# Altium schematic sheet Schematic.SchDoc
size A; SheetNumber: 1; SheetTotal: 1
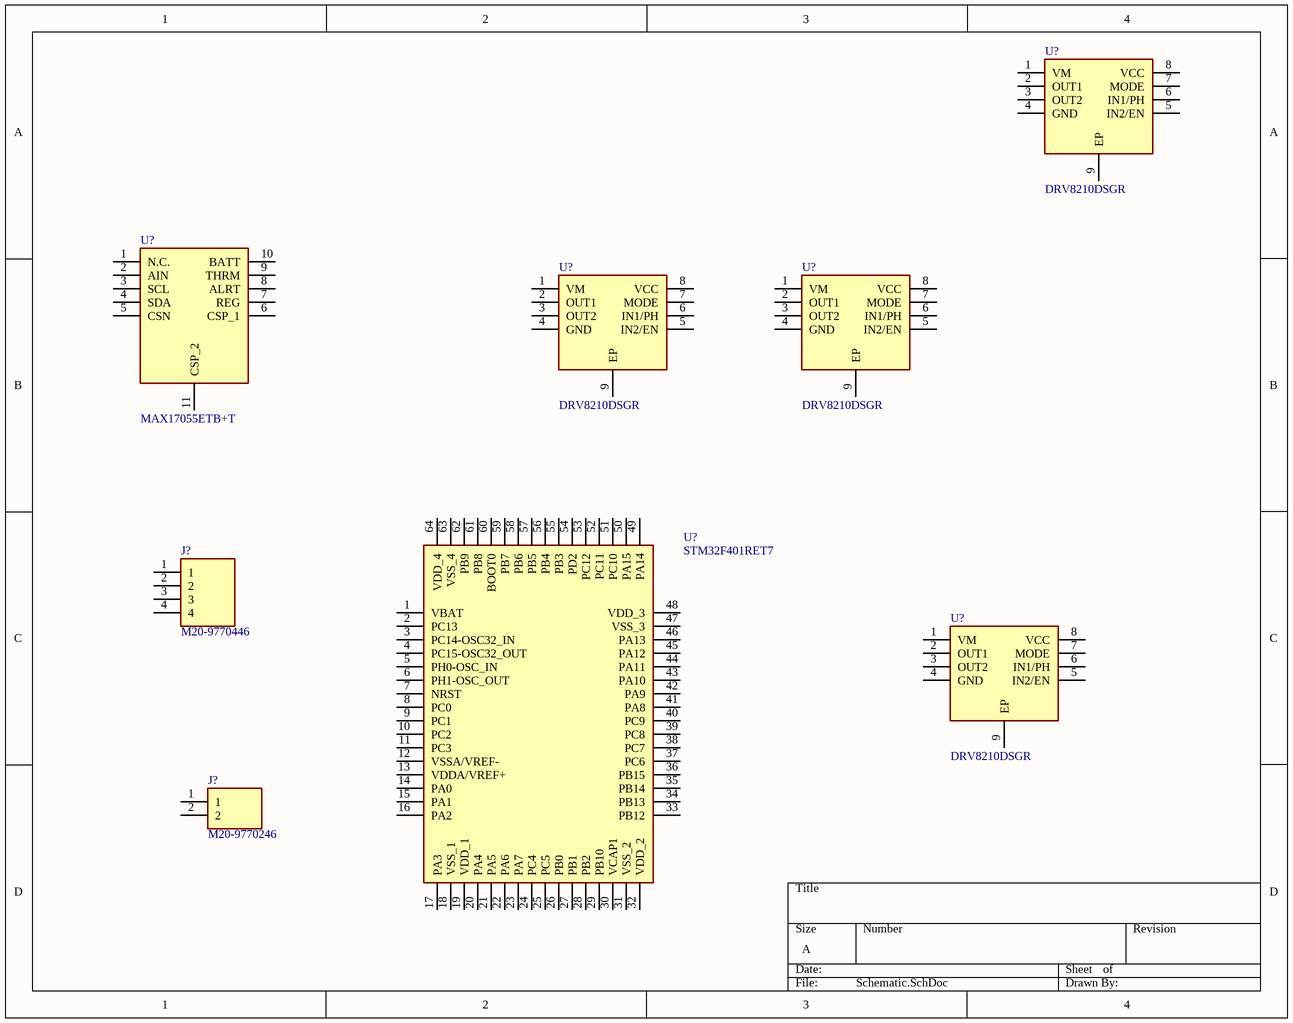
[diagram p0: Schematic.SchDoc]

## Parts
(Parts that share a designator on the sheet are numbered #1, #2 ... from top to bottom, then left to right.)
J?#1  M20-9770446  [HDRV4W64P0X254_1X4_1016X254X834P]
J?#2  M20-9770246  [HDRV2W66P0X254_1X2_508X254X762P]
U?#1  DRV8210DSGR  [SON50P200X200X80-9N]
U?#2  MAX17055ETB+T  [SON40P250X200X80-11N]
U?#3  DRV8210DSGR  [SON50P200X200X80-9N]
U?#4  DRV8210DSGR  [SON50P200X200X80-9N]
U?#5  STM32F401RET7  [QFP50P1200X1200X160-64N]
U?#6  DRV8210DSGR  [SON50P200X200X80-9N]

## Nets

Not connected (* = marked no-connect by the designer): J?#1 1 2 3 4; J?#2 1 2; U?#1 1(VM) 2(OUT1) 3(OUT2) 4(GND) 5(IN2/EN) 6(IN1/PH) 7(MODE) 8(VCC) 9(EP); U?#2 1(N.C.) 2(AIN) 3(SCL) 4(SDA) 5(CSN) 6(CSP_1) 7(REG) 8(ALRT) 9(THRM) 10(BATT) 11(CSP_2); U?#3 1(VM) 2(OUT1) 3(OUT2) 4(GND) 5(IN2/EN) 6(IN1/PH) 7(MODE) 8(VCC) 9(EP); U?#4 1(VM) 2(OUT1) 3(OUT2) 4(GND) 5(IN2/EN) 6(IN1/PH) 7(MODE) 8(VCC) 9(EP); U?#5 1(VBAT) 2(PC13) 3(PC14-OSC32_IN) 4(PC15-OSC32_OUT) 5(PH0-OSC_IN) 6(PH1-OSC_OUT) 7(NRST) 8(PC0) 9(PC1) 10(PC2) 11(PC3) 12(VSSA/VREF-) 13(VDDA/VREF+) 14(PA0) 15(PA1) 16(PA2) 17(PA3) 18(VSS_1) 19(VDD_1) 20(PA4) 21(PA5) 22(PA6) 23(PA7) 24(PC4) 25(PC5) 26(PB0) 27(PB1) 28(PB2) 29(PB10) 30(VCAP1) 31(VSS_2) 32(VDD_2) 33(PB12) 34(PB13) 35(PB14) 36(PB15) 37(PC6) 38(PC7) 39(PC8) 40(PC9) 41(PA8) 42(PA9) 43(PA10) 44(PA11) 45(PA12) 46(PA13) 47(VSS_3) 48(VDD_3) 49(PA14) 50(PA15) 51(PC10) 52(PC11) 53(PC12) 54(PD2) 55(PB3) 56(PB4) 57(PB5) 58(PB6) 59(PB7) 60(BOOT0) 61(PB8) 62(PB9) 63(VSS_4) 64(VDD_4); U?#6 1(VM) 2(OUT1) 3(OUT2) 4(GND) 5(IN2/EN) 6(IN1/PH) 7(MODE) 8(VCC) 9(EP)

## Library data of the parts
J?#1 = M20-9770446: Connector; Manufacturer_Name: Harwin; Datasheet Link: https://cdn.harwin.com/pdfs/M20-977.pdf; Height: 8.34mm; Manufacturer_Part_Number: M20-9770446; Mouser Part Number: 855-M20-9770446; Mouser Price/Stock: https://www.mouser.co.uk/ProductDetail/Harwin/M20-9770446?qs=ulE8k0yEMYbCPpMPHeYh4w%3D%3D
J?#2 = M20-9770246: Connector; Manufacturer_Name: Harwin; Datasheet Link: https://cdn.harwin.com/pdfs/M20-977.pdf; Height: 7.62mm; Manufacturer_Part_Number: M20-9770246; Mouser Part Number: 855-M20-9770246; Mouser Price/Stock: https://www.mouser.co.uk/ProductDetail/Harwin/M20-9770246?qs=ulE8k0yEMYYDEpAuGHphJw%3D%3D
U?#1 U?#3 U?#4 U?#6 = DRV8210DSGR: 12-V, 1.76-A H-bridge motor driver with auto sleep mode; Manufacturer_Name: Texas Instruments; Datasheet Link: https://www.ti.com/lit/ds/symlink/drv8210.pdf?ts=1614758859747&ref_url=https%253A%252F%252Fwww.mouser.in%252F; Height: 0.8mm; Manufacturer_Part_Number: DRV8210DSGR; Mouser Part Number: 595-DRV8210DSGR; Mouser Price/Stock: https://www.mouser.co.uk/ProductDetail/Texas-Instruments/DRV8210DSGR?qs=eP2BKZSCXI5lUYUnPPSnvA%3D%3D; Arrow Part Number: DRV8210DSGR; Arrow Price/Stock: https://www.arrow.com/en/products/drv8210dsgr/texas-instruments?region=nac
U?#2 = MAX17055ETB+T: IC BATT MON MULTI-CHEM 1C 10TDFN; Manufacturer_Name: Analog Devices; Datasheet Link: https://datasheets.maximintegrated.com/en/ds/MAX17055.pdf; Height: 0.8mm; Manufacturer_Part_Number: MAX17055ETB+T; Mouser Part Number: 700-MAX17055ETB+T; Mouser Price/Stock: https://www.mouser.co.uk/ProductDetail/Analog-Devices-Maxim-Integrated/MAX17055ETB%2bT?qs=u4fy%2FsgLU9MiRW9MH4Zm9g%3D%3D; Arrow Part Number: MAX17055ETB+T; Arrow Price/Stock: https://www.arrow.com/en/products/max17055etbt/maxim-integrated?region=nac
U?#5 = STM32F401RET7: ARM Microcontrollers - MCU STM32 Dynamic Efficiency MCU, Arm Cortex-M4 core DSP & FPU; Manufacturer_Name: STMicroelectronics; Datasheet Link: https://www.arrow.com/en/products/stm32f401ret7/stmicroelectronics; Height: 1.6mm; Manufacturer_Part_Number: STM32F401RET7; Mouser Part Number: 511-STM32F401RET7; Mouser Price/Stock: https://www.mouser.co.uk/ProductDetail/STMicroelectronics/STM32F401RET7?qs=aVyJF2WnouSdX21y3k%2FIAA%3D%3D; Arrow Part Number: STM32F401RET7; Arrow Price/Stock: null?region=nac